# EAGLE design LED (EAGLE 9.6.2)
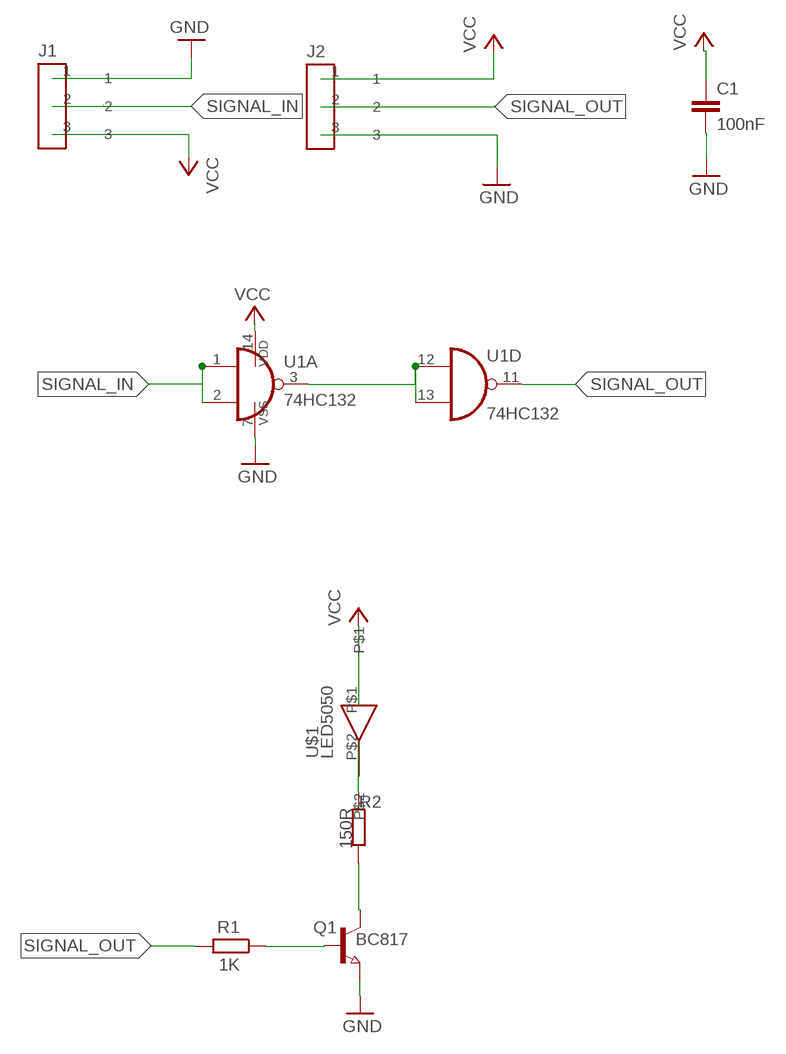
[diagram p0: schematic, sheet 1]

## Parts
C1  100nF  C-EUC0805  [C0805]
J1  CONECTOR_MACHO  [MALE]
J2  CONECTOR_FEMEA  [FEMALE]
Q1  BC817  NPN-TRANSISTOR_SOT23  [SOT23]
R1  1K  R-EU_R0805W  [R0805W]
R2  150R  R-EU_R0805W  [R0805W]
U1  74HC132  4011D  [SO14]
U$1  LED5050  [LED5050]

## Nets
GND: C1.2 J1.1 J2.3 Q1.2(E) U1.7(P:VSS)
LED: R2.2 U$1.P$2
N$2: Q1.1(B) R1.1
N$3: U1.3(A:O) U1.12(D:I0) U1.13(D:I1)
N$4: Q1.3(C) R2.1
SIGNAL_IN: J1.2 U1.1(A:I0) U1.2(A:I1)
SIGNAL_OUT: J2.2 R1.2 U1.11(D:O)
VCC: C1.1 J1.3 J2.1 U1.14(P:VDD) U$1.P$1
Unconnected: U1.4(B:O) U1.5(B:I0) U1.6(B:I1) U1.8(C:I0) U1.9(C:I1) U1.10(C:O)

## Library data of the parts
C1 = rcl:C-EU: CAPACITOR, European symbol; SPICEPREFIX: C
J1 = Eletroblocks Lib:CONECTOR_MACHO
J2 = Eletroblocks Lib:CONECTOR_FEMEA
Q1 = semicon-smd-ipc:NPN-TRANSISTOR_: NPN TRANSISTOR
R1 R2 = rcl:R-EU_: RESISTOR, European symbol; SPICEPREFIX: R
U1 = 40xx:4011: Quad 2-input NAND
U$1 = Eletroblocks Lib:LED5050

## Board
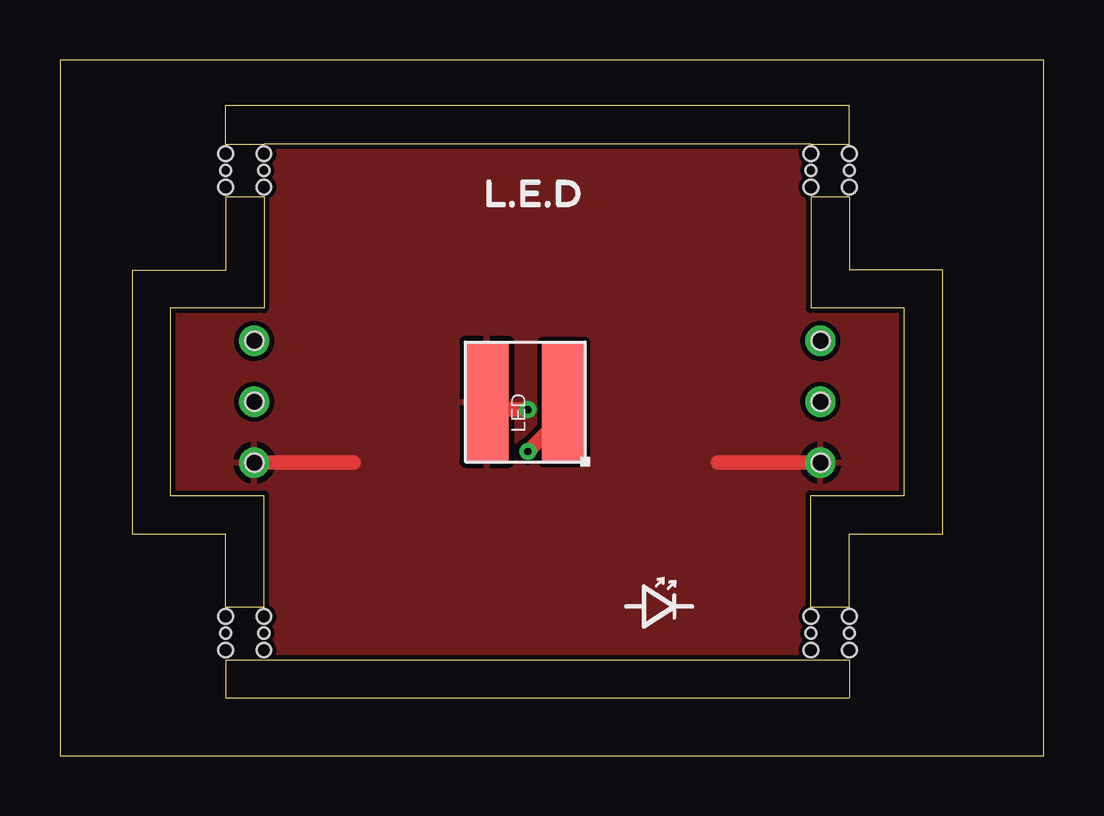
[diagram p1: board, top side]
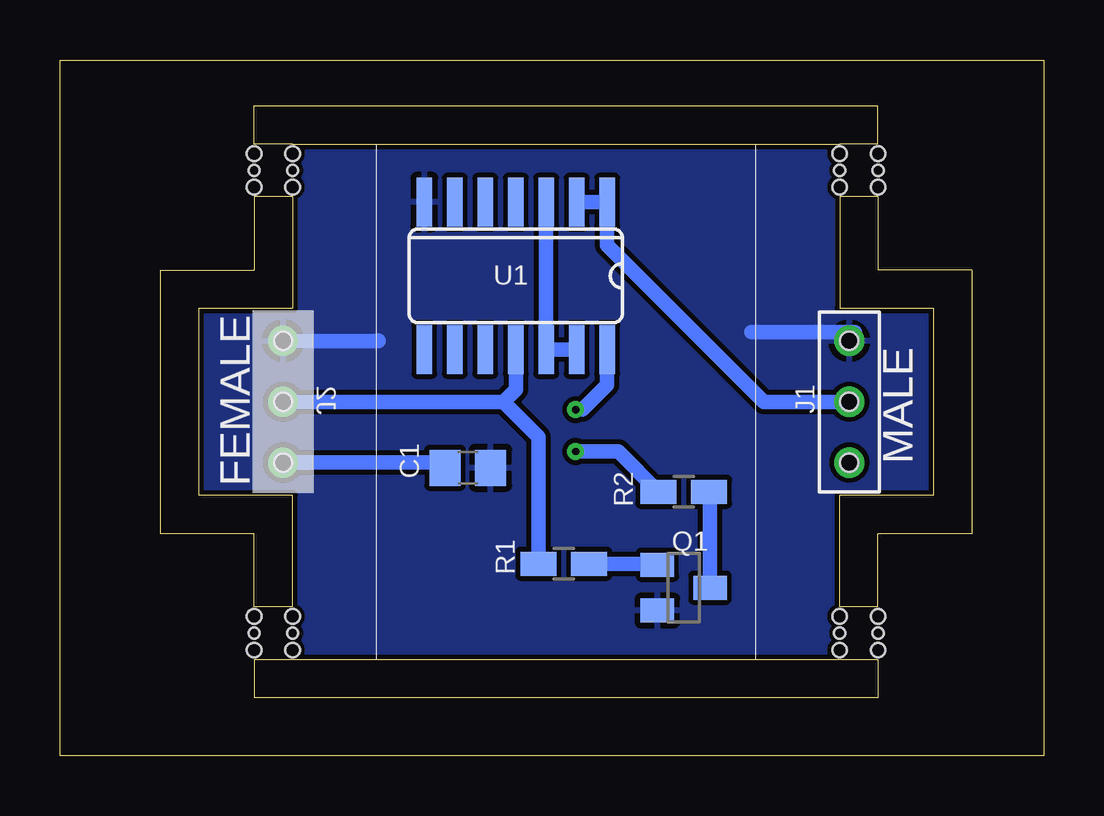
[diagram p2: board, bottom side, seen from below]

Size 41 x 29 mm. Coordinates in mm from the lower left corner, seen from the top.
Outline: 8.5,4 31.3,4
Outline: 31.3,25.5 8.5,25.5
Outline: 6.9,6.2 6.9,9.25 3,9.25 3,20.25 6.9,20.25 6.9,23.3
Outline: 8.5,6.2 8.5,10.85 4.6,10.85 4.6,18.65 8.5,18.65 8.5,23.3
Outline: 6.9,4 6.9,2.4 32.9,2.4 32.9,4
Outline: 32.9,6.2 32.9,9.25 36.8,9.25 36.8,20.25 32.9,20.25 32.9,23.3
Outline: 31.3,6.2 31.3,10.85 35.2,10.85 35.2,18.65 31.3,18.65 31.3,23.3
Outline: 32.9,25.5 32.9,27.1 6.9,27.1 6.9,25.5
Outline: 0,0 41,0 41,29 0,29 0,0
Copper layers (1*16): Top 0.035mm / dielectric 1.5mm / Bottom 0.035mm
Design rules "default *": minimum track width 8mil, minimum drill 0.35mm, track to track 8mil, track to pad 8mil, pad to pad 8mil, via to via 8mil, smd to smd 8mil, copper to edge 8mil, drill to drill 8mil, minimum pad ring 10mil, minimum via ring 8mil, stop-mask expansion 4mil, vias tented up to drill 1mm, thermal gap 10mil

### Footprints (pad centres in the part's own frame; a part is rotated, then mirrored left to right if it is on the bottom)
C0805 = smd 1.3 x 1.5: 1 -0.95,0; 2 0.95,0
MALE = drill 0.75: 1 0,2.54; 2 0,0; 3 0,-2.54 | hole 0.75: 0,2.54; 0,0; 0,-2.54
FEMALE = drill 0.75: 1 0,2.54; 2 0,0; 3 0,-2.54 | hole 0.75: 0,2.54; 0,0; 0,-2.54
SOT23 = smd 1 x 1.4: 1 -0.95,-1.1; 2 0.95,-1.1; 3 0,1.1
R0805W = smd 1.5 x 1: 1 -1.052,0; 2 1.052,0
SO14 = smd 0.66 x 2.032: 1 -3.81,-3.073; 2 -2.54,-3.073; 3 -1.27,-3.073; 4 0,-3.073; 5 1.27,-3.073; 6 2.54,-3.073; 7 3.81,-3.073; 8 3.81,3.073; 9 2.54,3.073; 10 1.27,3.073; 11 0,3.073; 12 -1.27,3.073; 13 -2.54,3.073; 14 -3.81,3.073
LED5050 = smd 1.8 x 5: P$1 -1.6,0; P$2 1.6,0
STAMP_DUPLO = hole 0.45: 0,0; 0,-1.6 | hole 0.6: 0.7,0; -0.7,0; 0.7,-1.6; -0.7,-1.6

### Placement (x,y rotation side)
C1  24,12 0 bottom
J1  8.1,14.75 0 top
J2  31.7,14.75 180 top
Q1  15,7 270 bottom
R1  20,8 180 bottom
R2  15,11 180 bottom
U1  22,20 180 bottom
U$1  19.4,14.75 0 top
U$2  [STAMP_DUPLO]  6.9,5.1 90 top
U$3  [STAMP_DUPLO]  6.9,24.4 90 top
U$4  [STAMP_DUPLO]  31.3,24.4 90 top
U$5  [STAMP_DUPLO]  31.3,5.1 90 top

### Tracks (layer width: path | path; a pad name or v marks a point on that pad's centre or on a via)
GND
  Bottom 0.61: J2.3 27.73,17.29 27.72,17.3 | J1.1 7.87,17.66 12.18,17.66
  pour Bottom: 4,4 4,26 36,26 36,4
LED  (via drill 0.3)
  Top 0.61: U$1.P$2 21,14.17 v19.5,12.68
  Bottom 0.61: R2.2 17.73,12.68 v19.5,12.68
N$2
  Bottom 0.61: Q1.1 16.15,8 R1.1
N$3
  Bottom 0.61: U1.3 U1.12 U1.13
N$4
  Bottom 0.61: Q1.3 13.9,10.95 R2.1
SIGNAL_IN
  Bottom 0.61: J1.2 11.65,14.75 18.19,21.29 U1.1 U1.2
SIGNAL_OUT
  Bottom 0.61: J2.2 22.52,14.75 | U1.11 22,15.27 22.52,14.75 | R1.2 21.05,13.29 22.52,14.75
VCC  (via drill 0.3)
  Top 0.61: J1.3 12.24,12.21 12.25,12.21 | J2.1 27.44,12.21 27.43,12.21 | v19.5,14.42 18.13,14.42 U$1.P$1
  Bottom 0.61: J2.1 25.16,12.21 C1.1 | U1.14 18.19,15.45 19.22,14.42 v19.5,14.42
  pour Top: 4,4 4,26 36,26 36,4

### Text on the board
tStop: V1.0.2
bStop: V1.0.2